# EAGLE design BSK3 (EAGLE 9.4.2)
ESKD_DESCRIPTION1: 207|235|224|242|224|32|193|209|202|51; ESKD_DESCRIPTION2: 241|245|229|236|224|32|253|235|229|234|242|240|232|247|229|241|234|224|255; ESKD_DESCRIPTION3: 239|240|232|237|246|232|239|232|224|235|252|237|224|255; ESKD_NUMBER: 67|67|83|49|46|50|52|48|48|45|48|221|51; ESKD_NUMBER_SHEET: 49; ESKD_SHEETS: 49
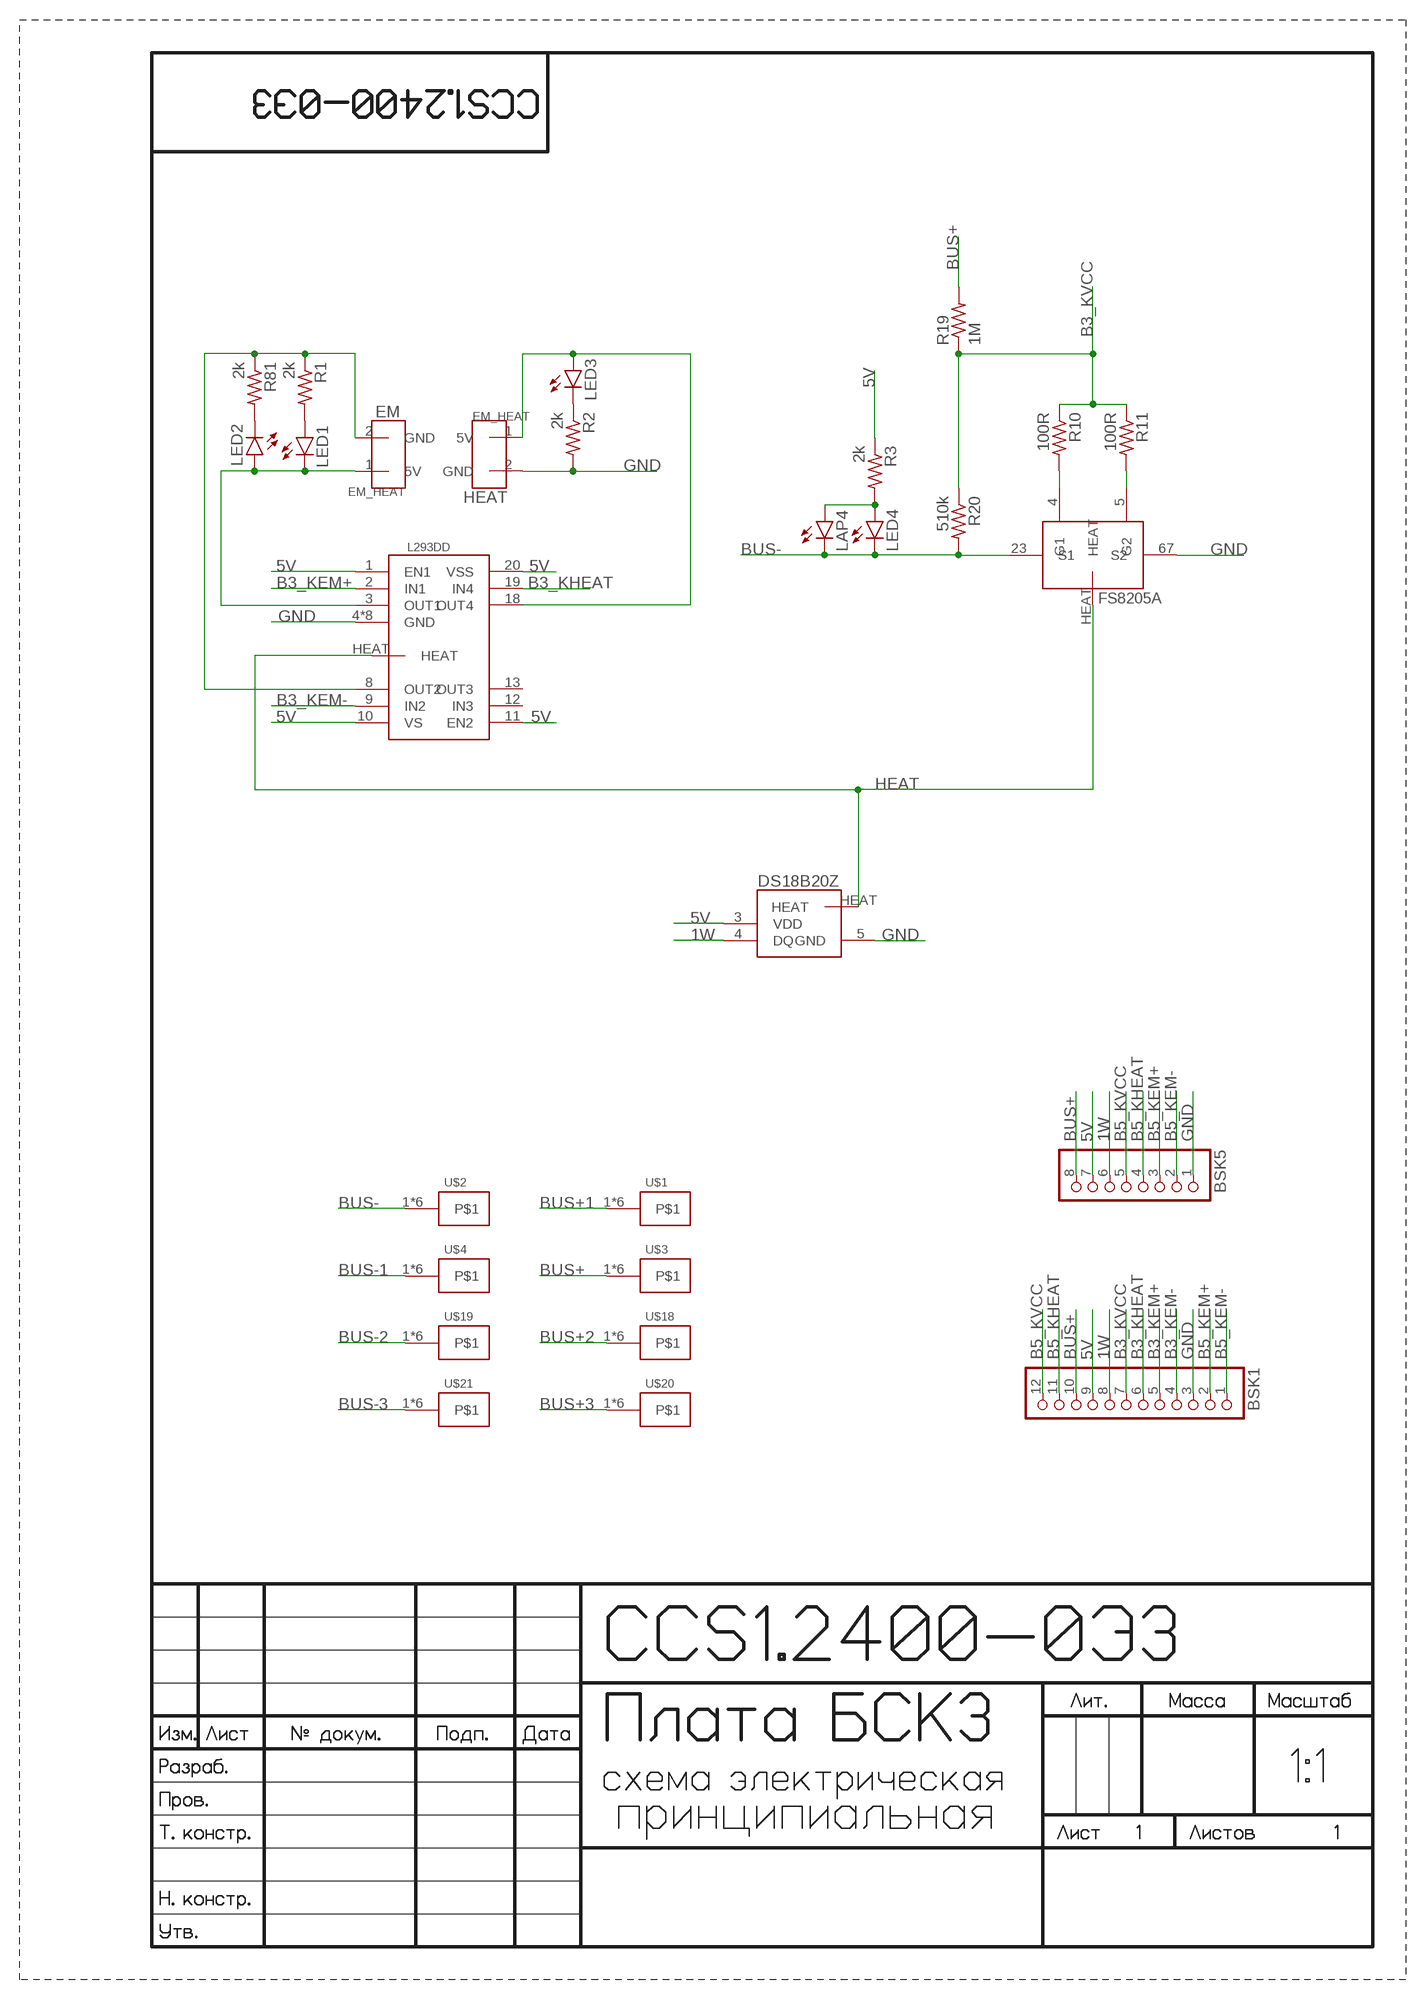
[diagram p0: schematic, sheet 1]

## Parts
BSK1  PINHD-1X12  [1X12]
BSK5  PINHD-1X8  [1X08]
DS18B20Z  DS18B20Z  [DS18B20Z]
FS8205A  FS8205A+  [FS8205A+]
L293DD  L293DD  [L293DD]
LAP4  LAP4-BOTTOM  [P47F-BOTTOM]
LED1  LEDCHIPLED_0603  [CHIPLED_0603]
LED2  LEDCHIPLED_0603  [CHIPLED_0603]
LED3  LEDCHIPLED_0603  [CHIPLED_0603]
LED4  LEDCHIPLED_0603  [CHIPLED_0603]
R1  2k  R-US_R0603  [R0603]
R2  2k  R-US_R0603  [R0603]
R3  2k  R-US_R0603  [R0603]
R10  100R  R-US_R0603  [R0603]
R11  100R  R-US_R0603  [R0603]
R19  1M  R-US_R0603  [R0603]
R20  510k  R-US_R0603  [R0603]
R81  2k  R-US_R0603  [R0603]
U$1  KCONNECT  [KCONNECT]
U$2  KCONNECT  [KCONNECT]
U$3  KCONNECT  [KCONNECT]
U$4  KCONNECT  [KCONNECT]
U$6  EM_HEAT  [EM_HEAT]
U$7  EM_HEAT  [EM_HEAT]
U$18  KCONNECT  [KCONNECT]
U$19  KCONNECT  [KCONNECT]
U$20  KCONNECT  [KCONNECT]
U$21  KCONNECT  [KCONNECT]

## Nets
1W: BSK1.8 BSK5.6 DS18B20Z.4(DQ)
5V: BSK1.9 BSK5.7 DS18B20Z.3(VDD) L293DD.1(EN1) L293DD.10(VS) L293DD.11(EN2) L293DD.20(VSS) R3.1
B3_KEM+: BSK1.5 L293DD.2(IN1)
B3_KEM-: BSK1.4 L293DD.9(IN2)
B3_KHEAT: BSK1.6 L293DD.19(IN4)
B3_KVCC: BSK1.7 R10.1 R11.1 R19.1 R20.1
B5_KEM+: BSK1.2 BSK5.3
B5_KEM-: BSK1.1 BSK5.2
B5_KHEAT: BSK1.11 BSK5.4
B5_KVCC: BSK1.12 BSK5.5
BUS+: BSK1.10 BSK5.8 R19.2 U$3.1 U$3.2 U$3.3 U$3.4 U$3.P$1 U$3.P$2
BUS+1: U$1.1 U$1.2 U$1.3 U$1.4 U$1.P$1 U$1.P$2
BUS+2: U$18.1 U$18.2 U$18.3 U$18.4 U$18.P$1 U$18.P$2
BUS+3: U$20.1 U$20.2 U$20.3 U$20.4 U$20.P$1 U$20.P$2
BUS-: FS8205A.23(S1) LAP4.C LED4.C R20.2 U$2.1 U$2.2 U$2.3 U$2.4 U$2.P$1 U$2.P$2
BUS-1: U$4.1 U$4.2 U$4.3 U$4.4 U$4.P$1 U$4.P$2
BUS-2: U$19.1 U$19.2 U$19.3 U$19.4 U$19.P$1 U$19.P$2
BUS-3: U$21.1 U$21.2 U$21.3 U$21.4 U$21.P$1 U$21.P$2
GND: BSK1.3 BSK5.1 DS18B20Z.5(GND) FS8205A.67(S2) L293DD.4(GND) L293DD.5(GND) L293DD.6(GND) L293DD.7(GND) L293DD.14(GND) L293DD.15(GND) L293DD.16(GND) L293DD.17(GND) R2.2 U$7.2(GND)
HEAT: DS18B20Z.HEAT FS8205A.HEAT L293DD.HEAT
N$1: L293DD.3(OUT1) LED1.C LED2.A U$6.1(5V)
N$2: L293DD.8(OUT2) R1.1 R81.1 U$6.2(GND)
N$3: L293DD.18(OUT4) LED3.A U$7.1(5V)
N$4: LED2.C R81.2
N$5: LED1.A R1.2
N$6: LED3.C R2.1
N$7: LAP4.A LED4.A R3.2
N$8: FS8205A.4(G1) R10.2
N$9: FS8205A.5(G2) R11.2
Unconnected: L293DD.12(IN3) L293DD.13(OUT3)

## Notes on the sheet
- EM
- HEAT

## Library data of the parts
BSK1 = pinheadCS:PINHD-1X12: PIN HEADER
BSK5 = pinheadCS:PINHD-1X8: PIN HEADER
DS18B20Z = CanCubeSat:DS18B20Z
FS8205A = CanCubeSat:FS8205A+
L293DD = CanCubeSat:L293DD
LAP4 = led:*P4: PointLED® Enhanced Thinfilm LED TOP & BOTTOM mount LS P47F, LR P47F, LA P47F, LY P47F, LT P4SG, LB P4SG, LW P4SG Source: http://catalog.osram-os.com .. LA_LR_LS_LY_P47F_Pb_free.pdf
LED1-LED4 = led:LED: LED OSRAM: - CHIPLED LG R971, LG N971, LY N971, LG Q971, LY Q971, LO R971, LY R971 LH N974, LH R974 LS Q976, LO Q976, LY Q976 LO Q996 - Hyper CHIPLED LW Q18S LB Q993, LB Q99A, LB R99A - SideLED LS A670, LO A670, LY A670, LG A670, LP A670 LB A673, LV A673, LT A673, LW A673 LH A674 LY A675 LS A676, LA A676, LO A676, LY A676, LW A676 LS A679, LY A679, LG A679 - Hyper Micro SIDELED® LS Y876, LA Y876, LO Y876, LY Y876 LT Y87S - SmartLED LW L88C, LW L88S LB L89C, LB L89S, LG L890 LS L89K, LO L89K, LY L89K LS L896, LA L896, LO L896, LY L896 - TOPLED LS T670, LO T670, LY T670, LG T670, LP T670 LSG T670, LSP T670, LSY T670, LOP T670, LYG T670 LG T671, LOG T671, LSG T671 LB T673, LV T673, LT T673, LW T673 LH T674 LS T676, LA T676, LO T676, LY T676, LB T676, LH T676, LSB T676, LW T676 LB T67C, LV T67C, LT T67C, LS T67K, LO T67K, LY T67K, LW E67C LS E67B, LA E67B, LO E67B, LY E67B, LB E67C, LV E67C, LT E67C LW T67C LS T679, LY T679, LG T679 LS T770, LO T770, LY T770, LG T770, LP T770 LB T773, LV T773, LT T773, LW T773 LH T774 LS E675, LA E675, LY E675, LS T675 LS T776, LA T776, LO T776, LY T776, LB T776 LHGB T686 LT T68C, LB T68C - Hyper Mini TOPLED® LB M676 - Mini TOPLED Santana® LG M470 LS M47K, LO M47K, LY M47K Source: http://www.osram.convergy.de LUXEON: - LUMILED® LXK2-PW12-R00, LXK2-PW12-S00, LXK2-PW14-U00, LXK2-PW14-V00 LXK2-PM12-R00, LXK2-PM12-S00, LXK2-PM14-U00 LXK2-PE12-Q00, LXK2-PE12-R00, LXK2-PE12-S00, LXK2-PE14-T00, LXK2-PE14-U00 LXK2-PB12-K00, LXK2-PB12-L00, LXK2-PB12-M00, LXK2-PB14-N00, LXK2-PB14-P00, LXK2-PB14-Q00 LXK2-PR12-L00, LXK2-PR12-M00, LXK2-PR14-Q00, LXK2-PR14-R00 LXK2-PD12-Q00, LXK2-PD12-R00, LXK2-PD12-S00 LXK2-PH12-R00, LXK2-PH12-S00 LXK2-PL12-P00, LXK2-PL12-Q00, LXK2-PL12-R00 Source: www.luxeon.com KINGBRIGHT: KA-3528ASYC Source: www.kingbright.com
R1-R3 R10 R11 R19 R20 R81 = resistor:R-US_: RESISTOR, American symbol
U$1-U$4 U$18-U$21 = CanCubeSat:KCONNECT
U$6 U$7 = CanCubeSat:EM_HEAT

## Board
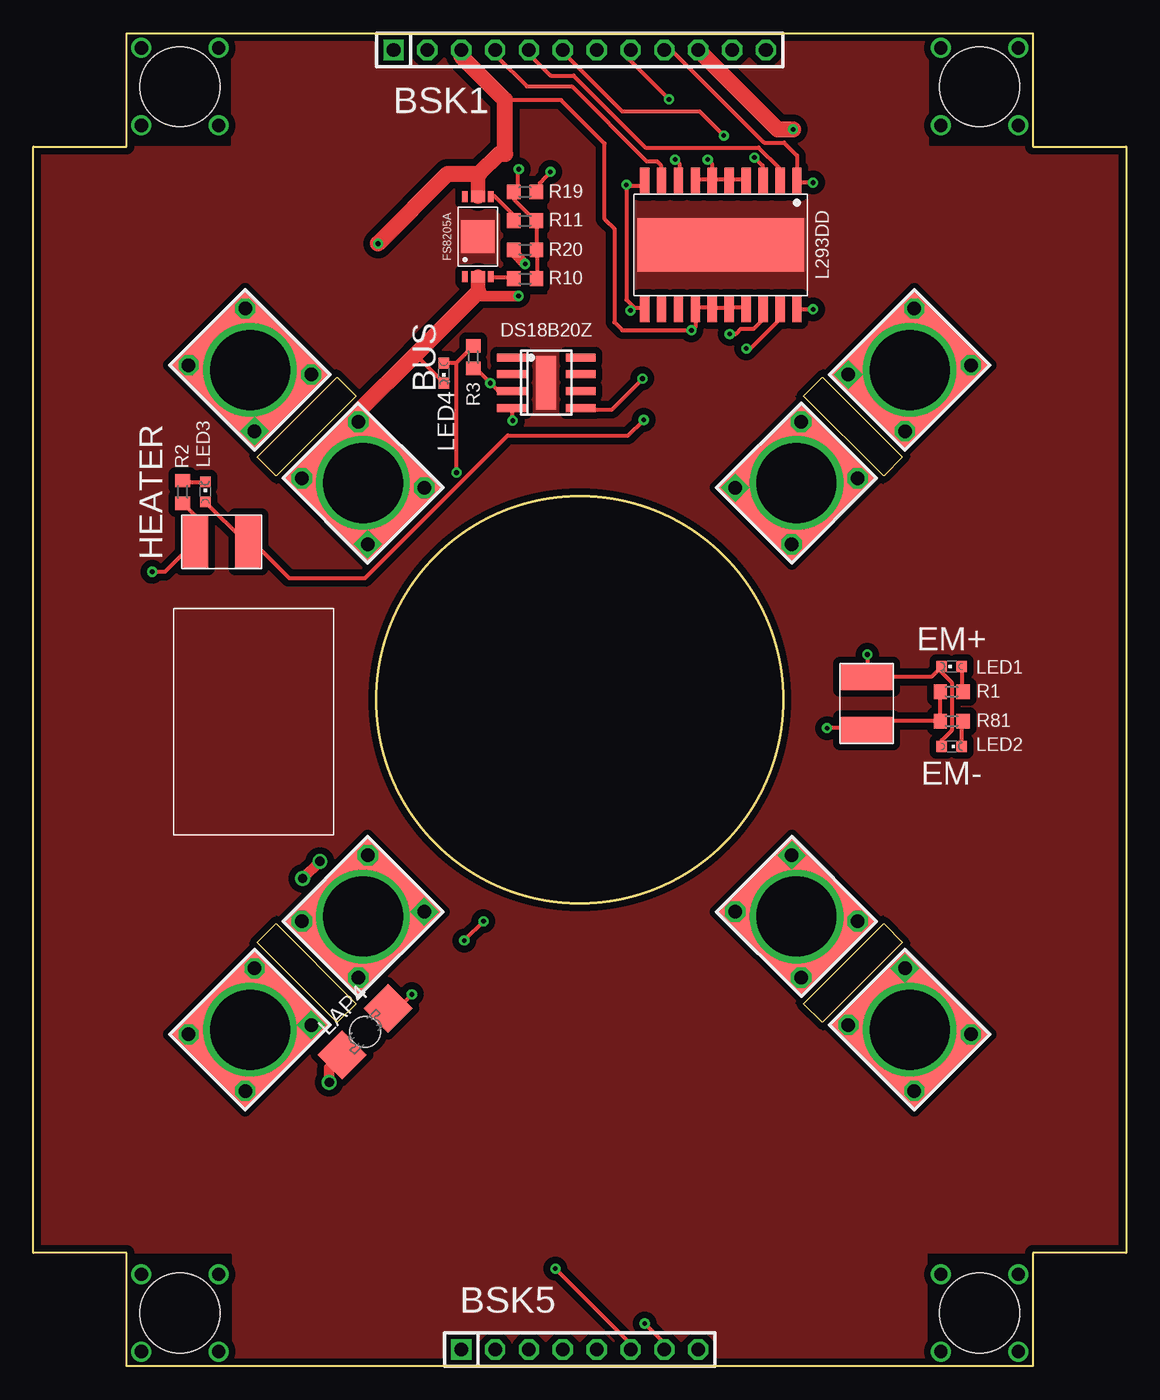
[diagram p1: board, top side]
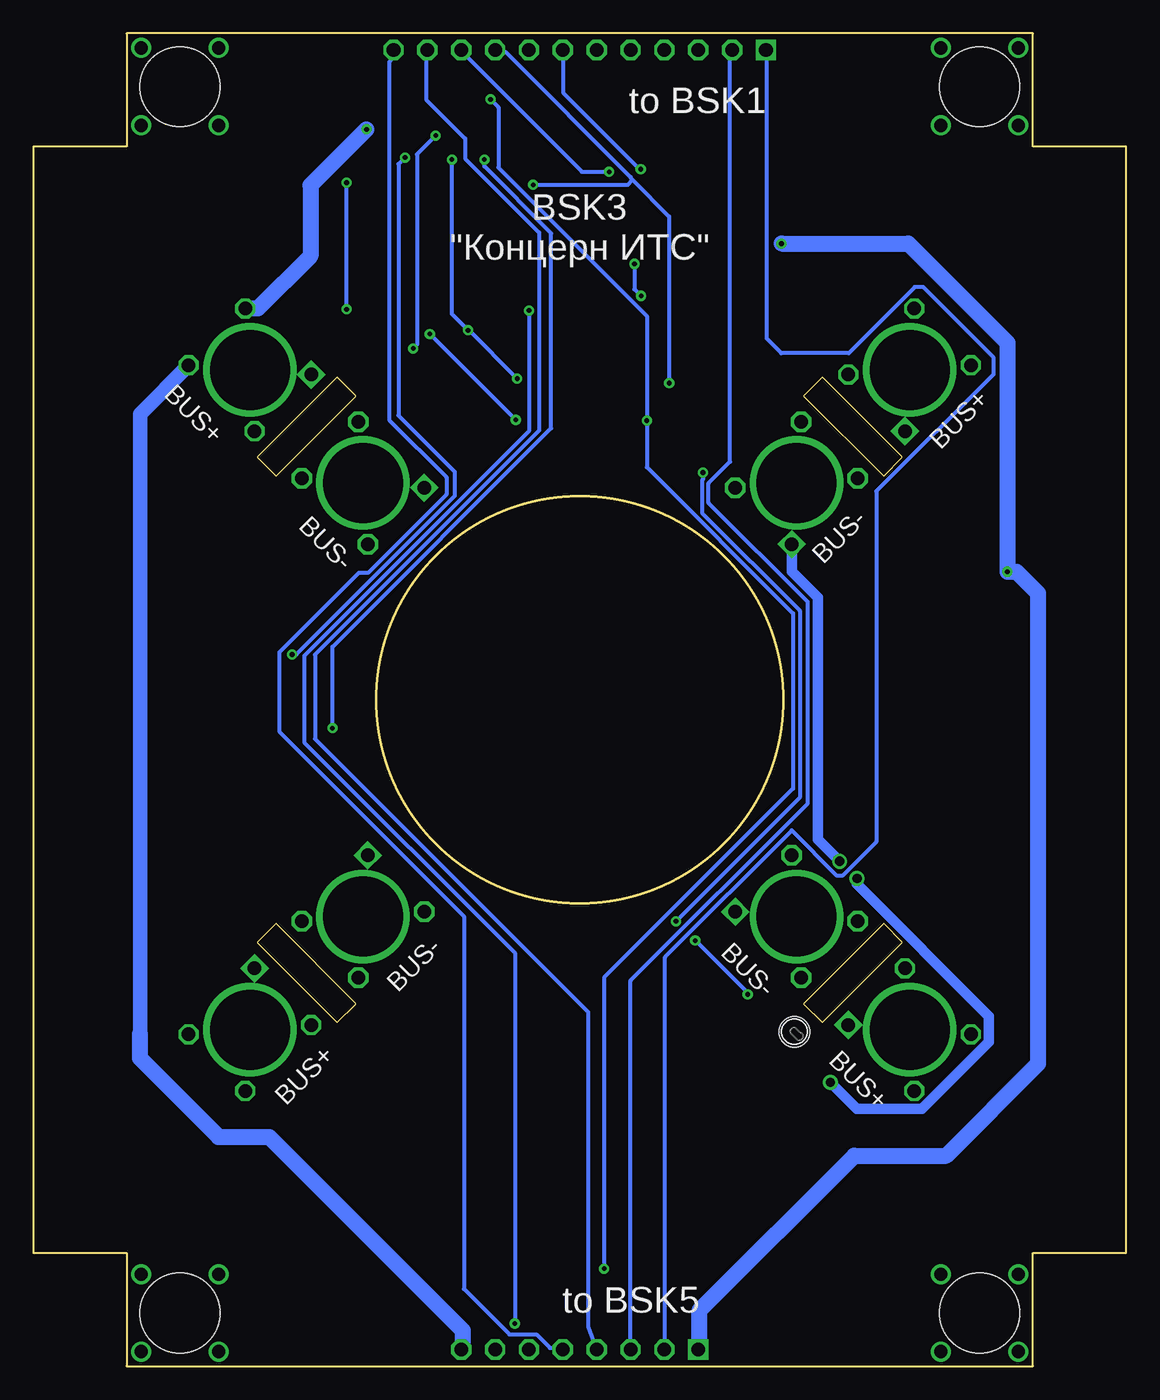
[diagram p2: board, bottom side, seen from below]

Size 82 x 100 mm. Coordinates in mm from the lower left corner, seen from the top.
Outline: 0,8.5 0,91.5 7,91.5 7,100 75,100 75,91.5 82,91.5 82,8.5 75,8.5 75,0 7,0 7,8.5 0,8.5
Outline: 57.79,27.2 63.8,33.21 65.22,31.79 59.21,25.78 57.79,27.2
Outline: 16.78,68.21 22.79,74.22 24.21,72.8 18.2,66.79 16.78,68.21
Outline: 63.8,66.79 57.79,72.8 59.21,74.22 65.22,68.21 63.8,66.79
Outline: 22.79,25.78 16.78,31.79 18.2,33.21 24.21,27.2 22.79,25.78
Outline: circle at 41,50 radius 15.25
Copper layers (1*16): Top 0.035mm / dielectric 1.5mm / Bottom 0.035mm
Design rules "default *": minimum track width 0.3mm, minimum drill 0.35mm, track to track 0.2mm, track to pad 0.2mm, pad to pad 0.2mm, via to via 0.2mm, smd to smd 0.2mm, copper to edge 0.25mm, drill to drill 6mil, minimum pad ring 10mil, minimum via ring 8mil, stop-mask expansion 2mil, vias tented up to drill 0mil, thermal gap 10mil
Holes 6 mm at 11,4 71,4 71,96 11,96

### Footprints (pad centres in the part's own frame; a part is rotated, then mirrored left to right if it is on the bottom)
1X12 = drill 1.016 square: 1 -13.97,0 | drill 1.016 octagon: 2 -11.43,0; 3 -8.89,0; 4 -6.35,0; 5 -3.81,0; 6 -1.27,0; 7 1.27,0; 8 3.81,0; 9 6.35,0; 10 8.89,0; 11 11.43,0; 12 13.97,0
1X08 = drill 1.016 square: 1 -8.89,0 | drill 1.016 octagon: 2 -6.35,0; 3 -3.81,0; 4 -1.27,0; 5 1.27,0; 6 3.81,0; 7 6.35,0; 8 8.89,0
DS18B20Z = smd 0.6 x 2.2: 1 -1.905,-2.6; 2 -0.635,-2.6; 3 0.635,-2.6; 4 1.905,-2.6; 5 1.905,2.6; 6 0.635,2.6; 7 -0.635,2.6; 8 -1.905,2.6 | smd 4 x 1.5: HEAT 0,0
FS8205A+ = smd 0.4 x 0.8: 1 -0.975,-3; 4 0.975,-3; 5 0.975,3; 8 -0.975,3 | smd 1.05 x 0.8: 23 0,-3; 67 0,3 | smd 2.5 x 2.5: HEAT 0,0
L293DD = smd 0.7 x 2: 1 -5.715,-4.8; 2 -4.445,-4.8; 3 -3.175,-4.8; 4 -1.905,-4.8; 5 -0.635,-4.8; 6 0.635,-4.8; 7 1.905,-4.8; 8 3.175,-4.8; 9 4.445,-4.8; 10 5.715,-4.8; 11 5.715,4.8; 12 4.445,4.8; 13 3.175,4.8; 14 1.905,4.8; 15 0.635,4.8; 16 -0.635,4.8; 17 -1.905,4.8; 18 -3.175,4.8; 19 -4.445,4.8; 20 -5.715,4.8 | smd 12.5 x 4: HEAT 0,0
P47F-BOTTOM = smd 2.6 x 2.6: A -2.45,0; C 2.45,0 | hole 2.3: 0,0
CHIPLED_0603 = smd 0.8 x 0.8: A 0,-0.75; C 0,0.75
R0603 = smd 1 x 1.1: 1 -0.85,0; 2 0.85,0
KCONNECT = drill 1.016 square: 1 -3,-3.5 | drill 1.016 octagon: 2 -3,3.5; 3 3,-3.5; 4 3,3.5 | drill 6: P$1 0,0 | smd 8 x 9: P$2 0,0
EM_HEAT = smd 2 x 4: 1 -2,0; 2 2,0

### Placement (x,y rotation side)
BSK1  41,98.75 0 top
BSK5  41,1.25 0 top
DS18B20Z  38.48,73.78 270 top
FS8205A  33.36,84.74 0 top
L293DD  51.58,84.12 180 top
LAP4  24.9,25.1 225 top
LED1  68.9,52.5 90 top
LED2  68.9,46.5 270 top
LED3  12.9,65.6 0 top
LED4  30.8,74.5 180 top
R1  68.9,50.6 0 top
R2  11.2,65.6 270 top
R3  33,75.7 90 top
R10  36.9,81.59 180 top
R11  36.89,85.94 180 top
R19  36.89,88.1 0 top
R20  36.9,83.76 180 top
R81  68.9,48.4 0 top
U$1  16.25,74.75 45 top
U$2  24.74,66.26 45 top
U$3  65.75,74.75 315 top
U$4  57.26,66.26 315 top
U$6  62.52,49.72 270 top
U$7  14.13,61.86 180 top
U$18  16.25,25.25 135 top
U$19  24.74,33.74 135 top
U$20  65.75,25.25 225 top
U$21  57.26,33.74 225 top

### Tracks (layer width: path | path; a pad name or v marks a point on that pad's centre or on a via)
1W  (via drill 0.35)
  Top 0.3: v35.97,70.94 35.97,71.78 DS18B20Z.4 | v47.7,95.05 44.65,98.09 44.65,98.45 44.81,98.6 BSK1.8 | v39.17,7.32 44.81,1.68 44.81,1.37 BSK5.6
  Bottom 0.3: v47.7,95.05 47.1,94.45 47.1,89.92 35.97,78.79 v35.97,70.94 35.97,67.46 24.99,56.48 24.99,43.34 39.17,29.16 v39.17,7.32
5V  (via drill 0.35)
  Top 0.3: DS18B20Z.3 35.81,73.15 34.9,73.15 v34.29,73.76 33.2,74.85 R3.1 | BSK1.9 47.89,98.75 54.84,91.81 56.33,91.81 57.3,90.83 57.3,89 L293DD.1 57.41,88.8 v58.5,88.8 | 45.05,79.45 44.5,80.02 v44.5,88.64 44.59,88.54 45.57,88.54 45.87,88.85 L293DD.10 | 45.05,79.45 45.11,79.4 45.72,79.4 L293DD.11 | v45.87,3.2 47.24,1.83 47.24,1.37 BSK5.7 | 45.05,79.45 v44.81,79.21 | L293DD.20 58.48,79.32 v58.5,79.3
  Bottom 0.3: v34.29,73.76 34.29,86.26 37.03,89 | 37.03,89 37.19,89.15 37.19,89.21 46.58,98.6 47.24,98.6 BSK1.9 | v45.87,3.2 45.87,31.01 61.67,46.81 61.67,53.29 44.81,70.15 v44.81,79.21 | 37.03,89 37.4,88.64 v44.5,88.64 | v58.5,79.3 v58.5,88.8
B3_KEM+
  Top 0.3: L293DD.2 55.93,89 55.93,89.92 54.42,91.43 45.93,91.43 40.54,96.82 38.81,96.82 37.34,98.3 37.34,98.6 BSK1.5
B3_KEM-
  Top 0.3: L293DD.9 47.09,89 47.09,90.11 46.8,90.4 46.02,90.4 40.4,96.02 37.03,96.02 34.75,98.3 34.75,98.6 BSK1.4
B3_KHEAT  (via drill 0.35)
  Top 0.3: v53.49,76.35 53.8,76.35 55.93,78.49 55.93,79.25 L293DD.19 | v51.8,92.33 49.99,94.14 44.18,94.14 39.78,98.55 39.78,98.6 BSK1.6
  Bottom 0.3: v53.49,76.35 53.21,76.63 53.21,90.92 v51.8,92.33
B3_KVCC  (via drill 0.35)
  Top 0.3: R10.1 37.8,81.69 37.8,83.67 R20.1 37.8,83.82 37.8,85.8 R11.1 37.64,85.95 36.12,87.48 36.12,88.09 R19.1 36.12,88.24 36.32,88.44 36.32,89.71 v36.42,89.81
  Bottom 0.3: v36.42,89.81 36.52,89.81 42.22,95.5 42.22,98.6 BSK1.7
B5_KEM+
  Bottom 0.3: BSK1.2 29.72,98.6 29.72,67.86 31.33,66.25 31.33,64.77 23.89,57.34 23.89,42.23 37.19,28.94 37.19,1.37 BSK5.3
B5_KEM-
  Bottom 0.3: BSK1.1 26.98,98.6 26.98,77.1 25.88,76 20.82,76 15.86,80.96 15.24,80.96 9.94,75.66 9.94,74.45 18.75,65.64 18.75,39.35 21.3,36.8 21.7,36.8 25.1,40.2 34.59,30.7 34.59,1.45 34.65,1.33 BSK5.2
B5_KHEAT
  Bottom 0.3: BSK1.11 52.53,98.65 52.53,95.03 49.6,92.1 49.6,90.6 44.05,85.05 44.05,70.19 60.87,53.38 60.87,47.06 40.38,26.57 40.38,2.94 BSK5.4
B5_KVCC
  Bottom 0.3: BSK5.5 42.37,1.37 43.23,1.37 44.25,2.39 46.28,2.39 49.68,5.8 49.68,33.76 63.54,47.62 63.54,53.55 57.58,59.51 56.89,59.51 51,65.4 51,66.7 55.3,71 55.3,97.84 55.24,97.91 BSK1.12
BUS+  (via drill 0.35)
  Top 0.3: v38.8,89.61 38,88.76 R19.2 | 65.38,74.52 65.53,74.52 65.68,74.68 U$3.P$2 | 65.38,74.52 61.27,74.52 U$3.1 | 65.99,75.13 65.99,74.98 65.84,74.83 U$3.P$2 | 65.99,75.13 65.99,79.25 U$3.2 | 65.99,75.13 70.26,75.13 U$3.4 | 65.99,75.13 U$3.P$2 | 65.38,74.52 65.38,70.26 U$3.3 | 65.38,74.52 U$3.P$2
  Top 1.2: BSK1.10 55.84,92.8 v57,92.8
  Bottom 0.3: v38.8,89.61 40.84,89.61 49.84,98.6 BSK1.10
  Bottom 1.1: 74,24.9 74,71.45 U$3.4
  Bottom 1.2: v57,92.8 61.2,88.6 61.2,83.3 65.15,79.35 U$3.2 | 74,24.9 74,23.1 68.1,17.2 64.3,17.2 49.79,2.69 49.79,1.35 BSK5.8
BUS+1
  Top 0.3: 16,74.98 11.73,74.98 U$1.2 | 16,74.98 16.15,74.83 U$1.P$2 | 16,74.98 16,79.25 U$1.4 | 16,74.98 U$1.P$2 | 16.46,74.37 16.46,74.52 16.31,74.68 U$1.P$2 | 16.46,74.37 16.46,70.26 U$1.1 | 16.46,74.37 20.73,74.37 U$1.3 | 16.46,74.37 U$1.P$2
BUS+2
  Top 0.3: 16,24.84 16,24.99 16.15,25.15 U$18.P$2 | 16,24.84 16,20.73 U$18.2 | 16,24.84 11.73,24.84 U$18.4 | 16,24.84 U$18.P$2 | 16.46,25.6 16.46,25.45 16.31,25.3 U$18.P$2 | 16.46,25.6 16.46,29.72 U$18.3 | 16.46,25.6 20.73,25.6 U$18.1 | 16.46,25.6 U$18.P$2
BUS+3
  Top 0.3: 65.99,24.84 65.99,24.99 65.84,25.15 U$20.P$2 | 65.99,24.84 65.99,20.73 U$20.4 | 65.38,25.6 61.27,25.6 U$20.3 | 65.38,25.6 65.68,25.3 U$20.P$2 | 65.99,24.84 70.26,24.84 U$20.2 | 65.99,24.84 U$20.P$2 | 65.38,25.6 65.38,29.72 U$20.1 | 65.38,25.6 U$20.P$2
BUS-  (via drill 0.35, 0.7)
  Top 0.3: U$2.2 20.27,66.6 24.69,66.6 U$2.P$2 | 24.99,65.84 24.99,65.99 24.84,66.14 U$2.P$2 | 24.99,65.84 24.99,61.72 U$2.1 | 24.99,65.84 29.26,65.84 U$2.3 | 24.99,65.84 U$2.P$2 | 33.49,80.49 33.38,80.6 | U$2.P$2 24.74,70.5 U$2.4 | 28.59,75.81 28.74,75.81 LED4.C
  Top 0.8: v36.9,82.7 36.05,83.55 R20.2 | v36.4,80.3 33.68,80.3 33.49,80.49 | v21.5,37.88 20.22,36.6 v20.2,36.6 | v22.2,21.3 22.2,22.4 LAP4.C
  Top 1.1: 33.38,80.6 33.38,81.72 FS8205A.23
  Top 1.2: 33.38,80.6 28.59,75.81 24.39,71.61 U$2.4
  Bottom 0.3: v36.9,82.7 36.9,80.8 v36.4,80.3
  Bottom 0.8: U$2.1 25.09,59.6 23.14,57.65 23.14,39.52 v21.5,37.88 | v20.2,36.6 20.2,36.16 10.29,26.26 10.29,24.33 15.33,19.29 20.19,19.29 v22.2,21.3
BUS-1
  Top 0.3: 57,65.99 57,61.72 U$4.3 | 57,65.99 57.15,66.14 U$4.P$2 | 57,65.99 52.73,65.99 U$4.1 | 57,65.99 U$4.P$2 | 57.61,66.6 57.61,70.71 U$4.2 | 57.61,66.6 57.3,66.29 U$4.P$2 | 57.61,66.6 61.72,66.6 U$4.4 | 57.61,66.6 U$4.P$2
BUS-2
  Top 0.3: 24.54,33.38 24.54,33.53 24.69,33.68 U$19.P$2 | 24.54,33.38 24.54,29.26 U$19.2 | 24.54,33.38 20.27,33.38 U$19.4 | 24.54,33.38 U$19.P$2 | 24.99,34.14 24.99,33.98 24.84,33.83 U$19.P$2 | 24.99,34.14 24.99,38.25 U$19.3 | 24.99,34.14 29.26,34.14 U$19.1 | 24.99,34.14 U$19.P$2
BUS-3
  Top 0.3: 57.61,33.38 57.61,29.26 U$21.4 | 57.61,33.38 57.3,33.68 U$21.P$2 | 57.61,33.38 61.72,33.38 U$21.2 | 57.61,33.38 U$21.P$2 | 56.84,33.98 57,33.98 57.15,33.83 U$21.P$2 | 56.84,33.98 52.73,33.98 U$21.3 | 56.84,33.98 56.84,38.25 U$21.1 | 56.84,33.98 U$21.P$2
GND  (via drill 0.35)
  Top 0.3: 50.9,89 49.68,89 L293DD.7 | L293DD.4 53.34,89 52.27,89 L293DD.5 52.12,89 51.05,89 L293DD.6 50.9,89 | L293DD.17 53.34,79.4 52.27,79.4 L293DD.16 52.12,79.4 51.05,79.4 L293DD.15 50.9,79.4 49.68,79.4 L293DD.14 49.68,79.25 49.68,78.03 v49.38,77.72 44.2,77.72 43.59,78.33 43.59,85.34 42.87,86.06 42.87,91.73 39.6,95 35.4,95 | DS18B20Z.5 41.15,71.78 43.43,71.78 45.7,74.05 v45.7,74.1 | 50.9,89 50.9,90.22 v50.6,90.53 | v8.92,59.6 9.87,59.6 U$7.2 12.13,63.82 R2.2
  Top 1.1: FS8205A.67 33.36,89.36 33.46,89.46
  Top 1.2: v25.86,84.22 31.1,89.46 33.46,89.46 34.97,90.97 35.4,90.97 35.4,95 32.11,98.29 BSK1.3
  Bottom 0.3: v50.6,90.53 50.6,78.94 v49.38,77.72 49.32,77.72 v45.7,74.1
  Bottom 1.2: BSK5.1 32,1.37 32,4.2 20.41,15.8 13.5,15.8 6.62,22.68 6.62,58 8.22,59.6 v8.92,59.6 8.92,76.78 16.36,84.22 v25.86,84.22
HEAT
  cutout Top: 16.25,68.25 18.25,66.25 24.75,72.75 22.75,74.75
  pour Top (isolate 0.5, no thermals): 0,91.5 14.9,91.5 14.9,100 67.1,100 67.1,91.5 82,91.5 82,8.5 67,8.5 67,0 15,0 15,8.4 14.9,8.5 0,8.5
  cutout Top: 35.3,89.2 35.3,80.5 38.5,80.5 38.5,89.2
HEAT1
  cutout Top: 57.25,27.25 59.25,25.25 65.75,31.75 63.75,33.75
HEAT2
  cutout Top: 63.75,66.25 65.75,68.25 59.25,74.75 57.25,72.75
HEAT3
  cutout Top: 22.75,25.25 24.75,27.25 18.25,33.75 16.25,31.75
N$1  (via drill 0.35)
  Top 0.3: v54.11,90.68 54.71,90.08 54.71,89 L293DD.3 | v62.58,53.39 62.58,51.78 U$6.1 67.37,51.72 LED1.C 68.15,52.05 68.9,51.3 68.9,47.7 68.15,46.95 LED2.A
  Bottom 0.3: v54.11,90.68 54.6,90.19 54.6,71.33 50.37,67.1 50.37,65.3 62.28,53.39 v62.58,53.39
N$2  (via drill 0.35)
  Top 0.3: v48.16,90.53 48.46,90.22 48.46,89 L293DD.8 | v59.55,47.87 61.98,47.87 62.13,47.72 U$6.2 63.2,48.4 R81.1 R1.1
  Bottom 0.3: v48.16,90.53 48.16,90.02 43.14,85 43.14,70.38 | v59.55,47.87 59.55,53.97
  Bottom 0.305: 59.55,53.97 43.14,70.38
N$3  (via drill 0.35)
  Top 0.3: L293DD.18 54.71,79.25 54.71,78.49 54.06,77.84 53.1,77.84 52.7,77.44 v52.25,77.44 | v45.8,71 44.63,69.83 35.59,69.83 24.88,59.13 19.2,59.13 16.47,61.86 U$7.1 15.89,61.86 LED3.A
  Bottom 0.3: v52.25,77.44 v52.24,77.44 v45.8,71
N$4
  Top 0.3: LED2.C 69.65,48.3 R81.2
N$5
  Top 0.3: LED1.A 69.65,50.7 R1.2
N$6
  Top 0.3: LED3.C 11.3,66.35 R2.1
N$7  (via drill 0.35)
  Top 0.3: R3.2 31.7,75.25 | 31.7,75.25 LED4.A | 31.7,75.25 31.7,67.1 v31.76,67.04 | v33.78,33.38 v32.34,31.93 | v32.34,31.93 | v28.4,27.9 27.33,26.83 LAP4.A
  Bottom 0.3: v31.76,67.04 31.76,66.52 31.83,66.45 31.83,64.02 24.49,56.69 24.49,42.66 v33.78,33.38 | v32.34,31.93 28.4,28 v28.4,27.9
N$8
  Top 0.3: FS8205A.4 34.44,81.69 35.97,81.69 R10.2
N$9
  Top 0.3: FS8205A.5 34.44,87.78 34.6,87.78 35.97,86.42 35.97,85.95 R11.2
N$11  (via drill 1)
  other vias: 8.1,6.9
N$12  (via drill 1)
  other vias: 8.1,1.1
N$13  (via drill 1)
  other vias: 13.9,1.1
N$14  (via drill 1)
  other vias: 13.9,6.9
N$15  (via drill 1)
  other vias: 68.1,6.9
N$16  (via drill 1)
  other vias: 68.1,1.1
N$17  (via drill 1)
  other vias: 73.9,1.1
N$18  (via drill 1)
  other vias: 73.9,6.9
N$19  (via drill 1)
  other vias: 68.1,98.9
N$20  (via drill 1)
  other vias: 68.1,93.1
N$21  (via drill 1)
  other vias: 73.9,93.1
N$22  (via drill 1)
  other vias: 73.9,98.9
N$23  (via drill 1)
  other vias: 8.1,98.9
N$24  (via drill 1)
  other vias: 8.1,93.1
N$25  (via drill 1)
  other vias: 13.9,93.1
N$26  (via drill 1)
  other vias: 13.9,98.9

### Text on the board
tPlace: BUS | HEATER | EM+ | EM-
bNames: to BSK1 | BSK3 / "Концерн ИТС" | BUS+ | BUS+ | BUS- | BUS- | BUS- | BUS- | BUS+ | BUS+ | to BSK5